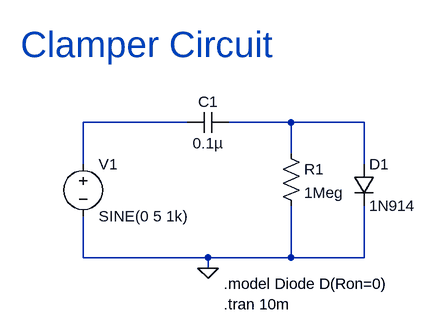
[diagram p0: schematic Clamping.asc]
Clamping.asc, the LTspice schematic file:
Version 4
SHEET 1 880 680
WIRE 176 64 16 64
WIRE 336 64 240 64
WIRE 448 64 336 64
WIRE 336 112 336 64
WIRE 16 128 16 64
WIRE 448 128 448 64
WIRE 16 272 16 208
WIRE 208 272 16 272
WIRE 336 272 336 192
WIRE 336 272 208 272
WIRE 448 272 448 192
WIRE 448 272 336 272
WIRE 208 288 208 272
FLAG 208 288 0
SYMBOL voltage 16 112 R0
WINDOW 123 0 0 Left 0
WINDOW 39 0 0 Left 0
SYMATTR InstName V1
SYMATTR Value SINE(0 5 1k)
SYMBOL cap 240 48 R90
WINDOW 0 0 32 VBottom 2
WINDOW 3 32 32 VTop 2
SYMATTR InstName C1
SYMATTR Value 0.1µ
SYMBOL diode 432 128 R0
SYMATTR InstName D1
SYMATTR Value 1N914
SYMBOL res 320 96 R0
SYMATTR InstName R1
SYMATTR Value 1Meg
TEXT 232 312 Left 2 !.model Diode D(Ron=0)
TEXT 232 344 Left 2 !.tran 10m
TEXT -80 -56 Left 5 ;Clamper Circuit

The netlist it stands for:
* Clamping.asc
V1 N001 0 SINE(0 5 1k)
C1 N002 N001 0.1µ
D1 N002 0 1N914
R1 N002 0 1Meg
.model D D
.lib standard.dio
.model Diode D(Ron=0)
.tran 10m
* Clamper Circuit
.backanno
.end